# Altium schematic sheet Main ESP32_IoT Gateaway.SchDoc
size 203 x 152 mm
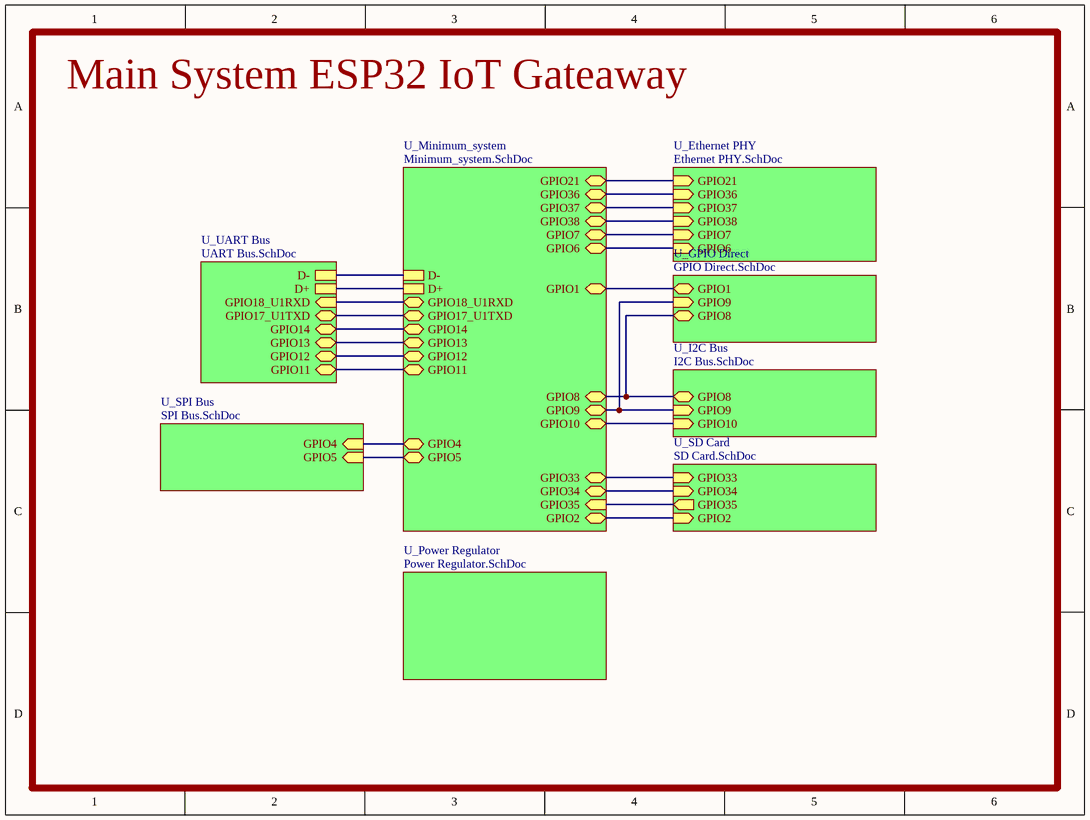
[diagram p0: Main ESP32_IoT Gateaway.SchDoc]

## Sub-sheets
U_Ethernet PHY = Ethernet PHY.SchDoc: GPIO21 (in), GPIO36 (in), GPIO37 (in), GPIO38 (in), GPIO6 (in), GPIO7 (in)
U_GPIO Direct = GPIO Direct.SchDoc: GPIO1 (bidir), GPIO9 (in), GPIO8 (bidir)
U_I2C Bus = I2C Bus.SchDoc: GPIO10 (in), GPIO9 (in), GPIO8 (bidir)
U_Minimum_system = Minimum_system.SchDoc: GPIO14 (bidir), GPIO13 (bidir), GPIO12 (bidir), GPIO11 (bidir), D-, D+, GPIO6 (bidir), GPIO7 (bidir), GPIO18_U1RXD (bidir), GPIO17_U1TXD (bidir), GPIO38 (bidir), GPIO37 (bidir), GPIO36 (bidir), GPIO21 (bidir), GPIO1 (bidir), GPIO5 (bidir), GPIO4 (bidir), GPIO2 (bidir), GPIO35 (in), GPIO34 (bidir), GPIO33 (bidir), GPIO10 (bidir), GPIO9 (bidir), GPIO8 (bidir)
U_Power Regulator = Power Regulator.SchDoc: no entries
U_SD Card = SD Card.SchDoc: GPIO33 (in), GPIO34 (in), GPIO35 (out), GPIO2 (in)
U_SPI Bus = SPI Bus.SchDoc: GPIO4 (in), GPIO5 (in)
U_UART Bus = UART Bus.SchDoc: GPIO12 (bidir), GPIO11 (bidir), GPIO13 (bidir), GPIO14 (bidir), GPIO17_U1TXD (bidir), GPIO18_U1RXD (in), D-, D+

## Nets
(unnamed): sheet U_UART Bus/GPIO12, sheet U_Minimum_system/GPIO12
(unnamed): sheet U_UART Bus/GPIO11, sheet U_Minimum_system/GPIO11
(unnamed): sheet U_UART Bus/GPIO13, sheet U_Minimum_system/GPIO13
(unnamed): sheet U_UART Bus/GPIO14, sheet U_Minimum_system/GPIO14
(unnamed): sheet U_UART Bus/GPIO17_U1TXD, sheet U_Minimum_system/GPIO17_U1TXD
(unnamed): sheet U_UART Bus/GPIO18_U1RXD, sheet U_Minimum_system/GPIO18_U1RXD
(unnamed): sheet U_UART Bus/D-, sheet U_Minimum_system/D-
(unnamed): sheet U_UART Bus/D+, sheet U_Minimum_system/D+
(unnamed): sheet U_Minimum_system/GPIO6, sheet U_Ethernet PHY/GPIO6
(unnamed): sheet U_Minimum_system/GPIO7, sheet U_Ethernet PHY/GPIO7
(unnamed): sheet U_Minimum_system/GPIO38, sheet U_Ethernet PHY/GPIO38
(unnamed): sheet U_Minimum_system/GPIO37, sheet U_Ethernet PHY/GPIO37
(unnamed): sheet U_Minimum_system/GPIO36, sheet U_Ethernet PHY/GPIO36
(unnamed): sheet U_Minimum_system/GPIO21, sheet U_Ethernet PHY/GPIO21
(unnamed): sheet U_Minimum_system/GPIO1, sheet U_GPIO Direct/GPIO1
(unnamed): sheet U_Minimum_system/GPIO5, sheet U_SPI Bus/GPIO5
(unnamed): sheet U_Minimum_system/GPIO4, sheet U_SPI Bus/GPIO4
(unnamed): sheet U_Minimum_system/GPIO2, sheet U_SD Card/GPIO2
(unnamed): sheet U_Minimum_system/GPIO35, sheet U_SD Card/GPIO35
(unnamed): sheet U_Minimum_system/GPIO34, sheet U_SD Card/GPIO34
(unnamed): sheet U_Minimum_system/GPIO33, sheet U_SD Card/GPIO33
(unnamed): sheet U_Minimum_system/GPIO10, sheet U_I2C Bus/GPIO10
(unnamed): sheet U_Minimum_system/GPIO9, sheet U_I2C Bus/GPIO9, sheet U_GPIO Direct/GPIO9
(unnamed): sheet U_Minimum_system/GPIO8, sheet U_I2C Bus/GPIO8, sheet U_GPIO Direct/GPIO8

## Notes on the sheet
- Main System ESP32 IoT Gateaway